# EAGLE design PCB (EAGLE 7.7.0)
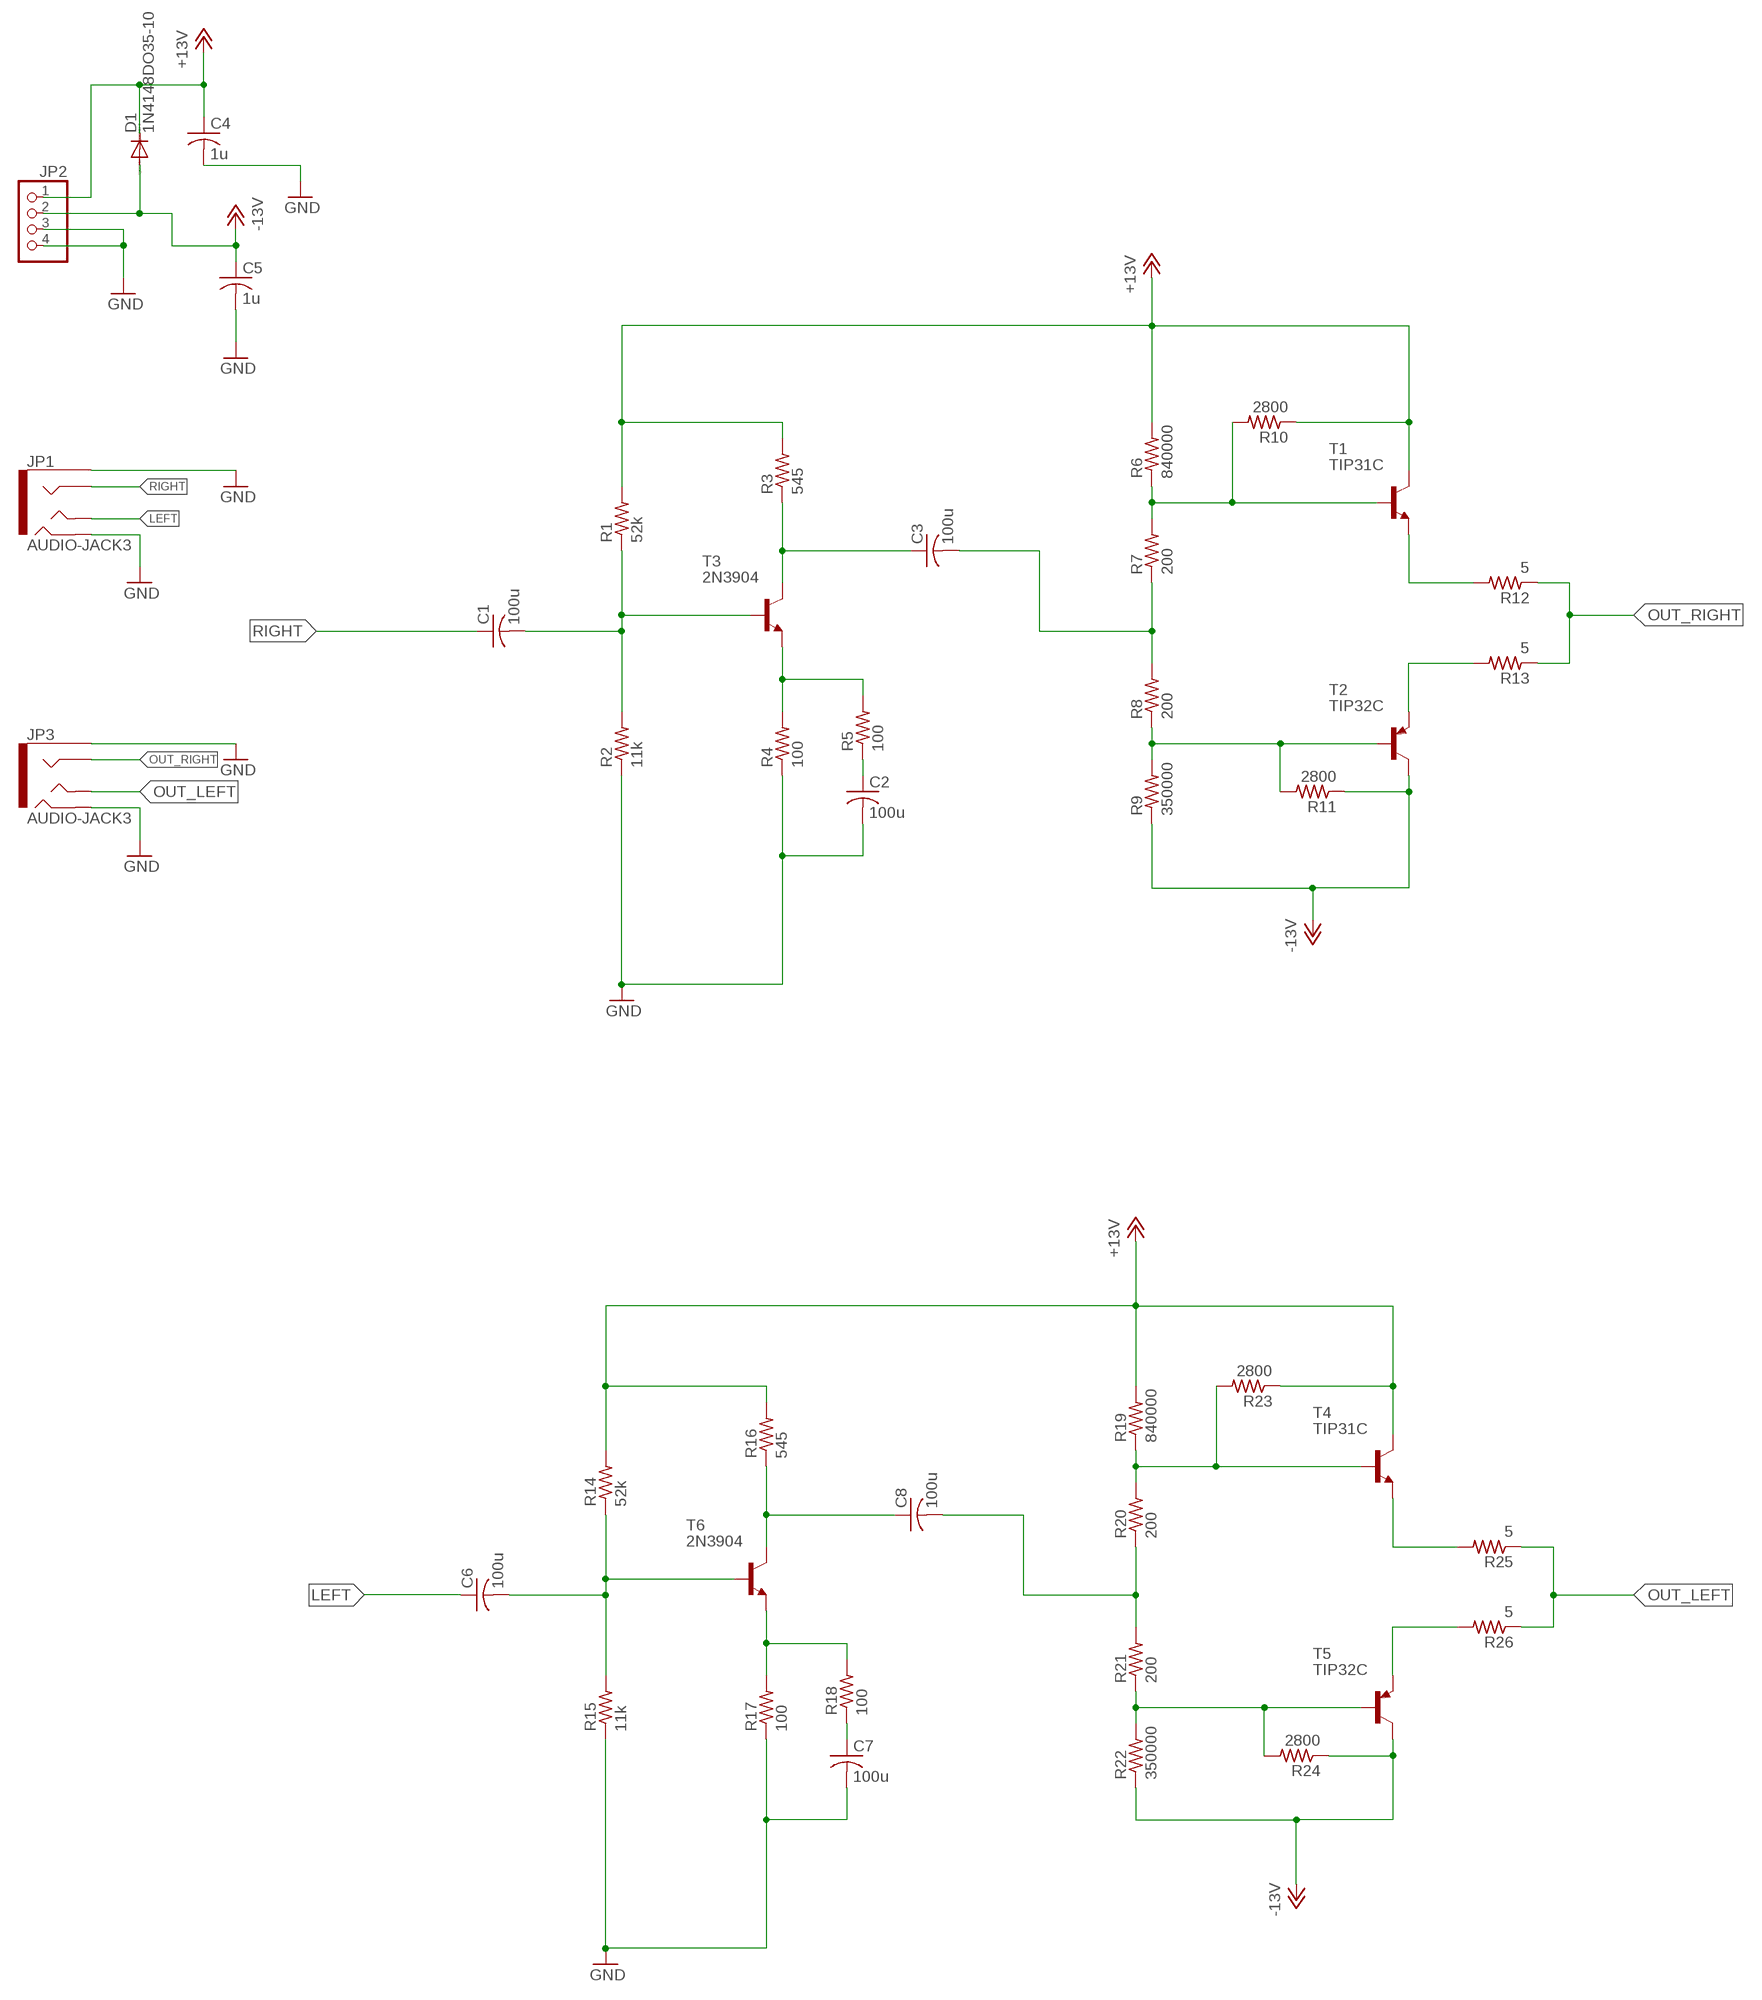
[diagram p0: schematic, sheet 1]

## Parts
C1  100u  C-US025-024X044  [C025-024X044]
C2  100u  C-US025-024X044  [C025-024X044]
C3  100u  C-US025-024X044  [C025-024X044]
C4  1u  C-US025-024X044  [C025-024X044]
C5  1u  C-US025-024X044  [C025-024X044]
C6  100u  C-US025-024X044  [C025-024X044]
C7  100u  C-US025-024X044  [C025-024X044]
C8  100u  C-US025-024X044  [C025-024X044]
D1  1N4148DO35-10  [DO35-10]
JP1  AUDIO-JACK3  [AUDIO-JACK-TRRS-SMD]
JP2  PINHD-1X4  [1X04]
JP3  AUDIO-JACK3  [AUDIO-JACK-TRRS-SMD]
R1  52k  R-US_0204/2V  [0204V]
R2  11k  R-US_0204/2V  [0204V]
R3  545  R-US_0204/2V  [0204V]
R4  100  R-US_0204/2V  [0204V]
R5  100  R-US_0204/2V  [0204V]
R6  840000  R-US_0204/2V  [0204V]
R7  200  R-US_0204/2V  [0204V]
R8  200  R-US_0204/2V  [0204V]
R9  350000  R-US_0204/2V  [0204V]
R10  2800  R-US_0204/2V  [0204V]
R11  2800  R-US_0204/2V  [0204V]
R12  5  R-US_0204/2V  [0204V]
R13  5  R-US_0204/2V  [0204V]
R14  52k  R-US_0204/2V  [0204V]
R15  11k  R-US_0204/2V  [0204V]
R16  545  R-US_0204/2V  [0204V]
R17  100  R-US_0204/2V  [0204V]
R18  100  R-US_0204/2V  [0204V]
R19  840000  R-US_0204/2V  [0204V]
R20  200  R-US_0204/2V  [0204V]
R21  200  R-US_0204/2V  [0204V]
R22  350000  R-US_0204/2V  [0204V]
R23  2800  R-US_0204/2V  [0204V]
R24  2800  R-US_0204/2V  [0204V]
R25  5  R-US_0204/2V  [0204V]
R26  5  R-US_0204/2V  [0204V]
T1  TIP31C  [TO220]
T2  TIP32C  [TO220]
T3  2N3904  [TO92]
T4  TIP31C  [TO220]
T5  TIP32C  [TO220]
T6  2N3904  [TO92]

## Nets
+13V: C4.1 D1.C JP2.1 R1.2 R3.2 R6.2 R10.1 R14.2 R16.2 R19.2 R23.1 T1.2(C) T4.2(C)
-13V: C5.1 D1.A JP2.2 R9.1 R11.1 R22.1 R24.1 T2.2(C) T5.2(C)
GND: C2.2 C4.2 C5.2 C7.2 JP1.EARTH JP1.RING2 JP2.3 JP2.4 JP3.EARTH JP3.RING2 R2.1 R4.1 R15.1 R17.1
LEFT: C6.1 JP1.TIP
N$1: C1.2 R1.1 R2.2 T3.2(B)
N$2: C3.1 R3.1 T3.1(C)
N$3: C6.2 R14.1 R15.2 T6.2(B)
N$4: R4.2 R5.2 T3.3(E)
N$5: R6.1 R7.2 R10.2 T1.1(B)
N$6: C2.1 R5.1
N$7: C3.2 R7.1 R8.2
N$8: R8.1 R9.2 R11.2 T2.1(B)
N$9: R12.2 T1.3(E)
N$10: R13.2 T2.3(E)
N$12: C8.1 R16.1 T6.1(C)
N$13: R17.2 R18.2 T6.3(E)
N$14: C7.1 R18.1
N$15: R19.1 R20.2 R23.2 T4.1(B)
N$16: C8.2 R20.1 R21.2
N$17: R21.1 R22.2 R24.2 T5.1(B)
N$18: R25.2 T4.3(E)
N$19: R26.2 T5.3(E)
OUT_LEFT: JP3.TIP R25.1 R26.1
OUT_RIGHT: JP3.RING1 R12.1 R13.1
RIGHT: C1.1 JP1.RING1

## Library data of the parts
C1-C8 = resistor:C-US: CAPACITOR, American symbol
D1 = diode:1N4148: DIODE high speed (Philips)
JP1 JP3 = SparkFun-Connectors:AUDIO-JACK3: Audio jack - 3.5mm TRRS variety - two rings.
JP2 = pinhead:PINHD-1X4: PIN HEADER
R1-R26 = resistor:R-US_: RESISTOR, American symbol
T1 T4 = transistor:TIP31: NPN Transistor Medium Power Linear Switching Applications Source: http://onsemi.com
T2 T5 = transistor:TIP32: PNP Transistor Medium Power Linear Switching Applications Source: http://onsemi.com
T3 T6 = transistor:2N3904: NPN TRANSISTOR

## Board
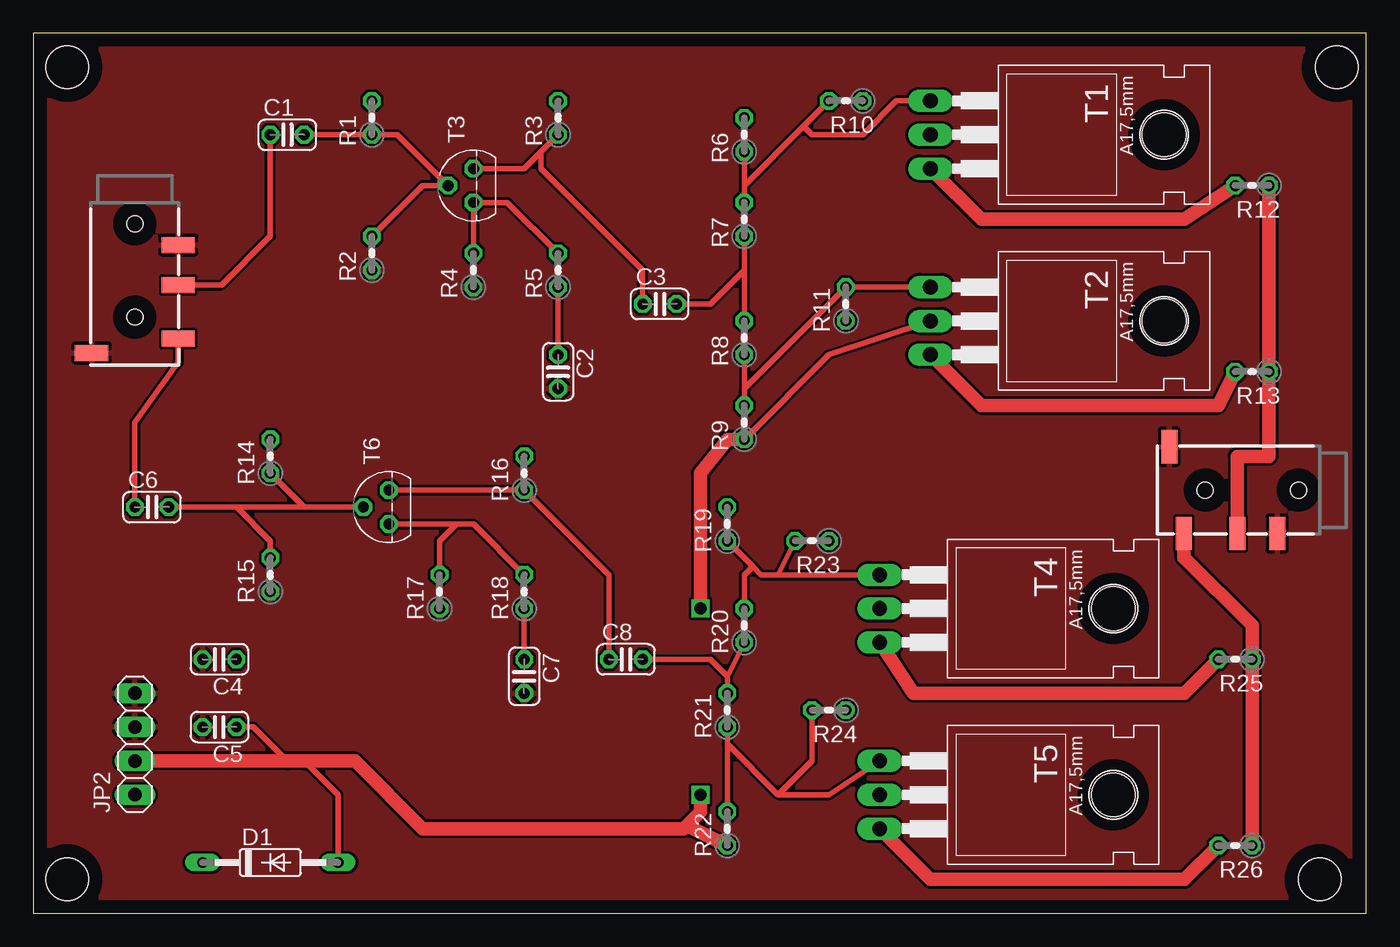
[diagram p1: board, top side]
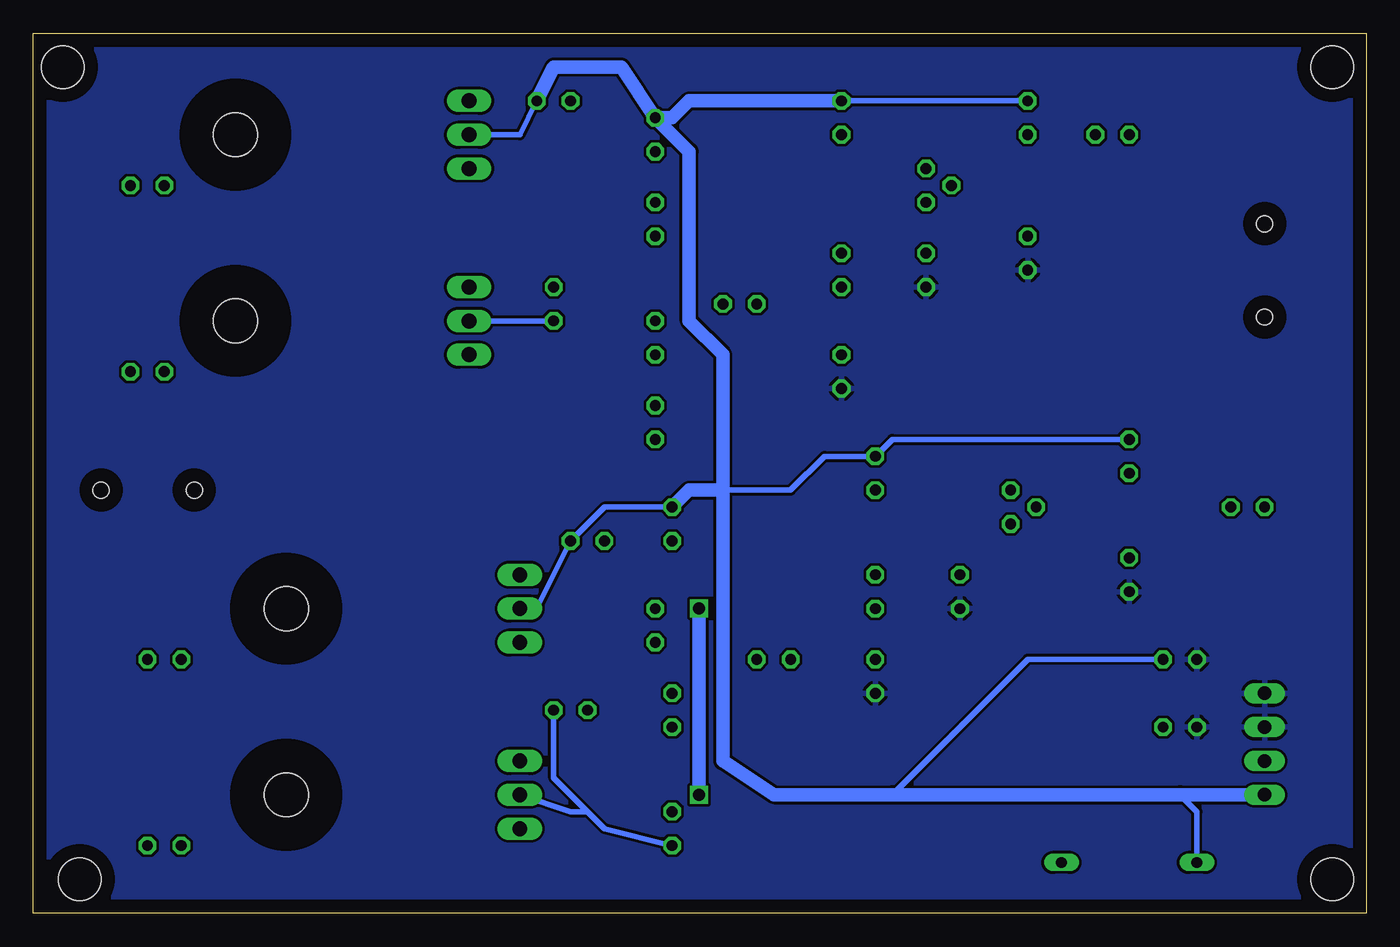
[diagram p2: board, bottom side, seen from below]

Size 100 x 66.03 mm. Coordinates in mm from the lower left corner, seen from the top.
Outline: 0,0 100,0 100,66.03 0,66.03 0,0
Copper layers (1*16): Top 0.035mm / dielectric 1.5mm / Bottom 0.035mm
Design rules "default": minimum track width 10mil, minimum drill 24mil, track to track 8mil, track to pad 8mil, pad to pad 8mil, via to via 8mil, smd to smd 8mil, copper to edge 40mil, drill to drill 8mil, minimum pad ring 10mil, minimum via ring 8mil, stop-mask expansion 4mil, vias tented up to drill 0mil, thermal gap 10mil
Holes 3.2 mm at 2.54,63.5 2.54,2.54 96.52,2.54 97.79,63.5

### Footprints (pad centres in the part's own frame; a part is rotated, then mirrored left to right if it is on the bottom)
C025-024X044 = drill 0.813 octagon: 1 -1.27,0; 2 1.27,0
DO35-10 = drill 0.813 long: A 5.08,0; C -5.08,0
AUDIO-JACK-TRRS-SMD = smd 1.2 x 2.5: EARTH 11.3,-3.25; RING1 6.2,3.25; RING2 3.2,3.25; TIP 10.2,3.25 | hole 1.2: 1.6,0; 8.6,0
1X04 = drill 1.016 long: 1 -3.81,0; 2 -1.27,0; 3 1.27,0; 4 3.81,0
0204V = drill 0.813 octagon: 1 -1.27,0; 2 1.27,0
TO220 = drill 1.118 long: 1 -2.54,-6.35; 2 0,-6.35; 3 2.54,-6.35 | hole 3.302: 0,11.176
TO92 = drill 0.813 octagon: 1 1.27,0; 2 0,1.905; 3 -1.27,0

### Placement (x,y rotation side)
C1  19.05,58.42 0 top
C2  39.37,40.64 270 top
C3  46.99,45.72 0 top
C4  13.97,19.05 180 top
C5  13.97,13.97 180 top
C6  8.89,30.48 0 top
C7  36.83,17.78 270 top
C8  44.45,19.05 0 top
D1  17.78,3.81 0 top
JP1  7.62,53.34 270 top
JP2  7.62,12.7 90 top
JP3  96.52,31.75 180 top
R1  25.4,59.69 90 top
R2  25.4,49.53 90 top
R3  39.37,59.69 90 top
R4  33.02,48.26 90 top
R5  39.37,48.26 90 top
R6  53.34,58.42 90 top
R7  53.34,52.07 90 top
R8  53.34,43.18 90 top
R9  53.34,36.83 90 top
R10  60.96,60.96 180 top
R11  60.96,45.72 90 top
R12  91.44,54.61 180 top
R13  91.44,40.64 180 top
R14  17.78,34.29 90 top
R15  17.78,25.4 90 top
R16  36.83,33.02 90 top
R17  30.48,24.13 90 top
R18  36.83,24.13 90 top
R19  52.07,29.21 90 top
R20  53.34,21.59 90 top
R21  52.07,15.24 90 top
R22  52.07,6.35 90 top
R23  58.42,27.94 180 top
R24  59.69,15.24 180 top
R25  90.17,19.05 180 top
R26  90.17,5.08 180 top
T1  73.66,58.42 270 top
T2  73.66,44.45 270 top
T3  33.02,54.61 90 top
T4  69.85,22.86 270 top
T5  69.85,8.89 270 top
T6  26.67,30.48 90 top

### Tracks (layer width: path | path; a pad name or v marks a point on that pad's centre or on a via)
+13V
  Bottom 0.406: R10.1 63.5,58.42 T1.2 | R19.2 57.15,30.48 R23.1 62.23,22.86 T4.2 | R3.2 R1.2 | 48.26,31.75 43.18,31.75 40.64,34.29 R16.2 35.56,35.56 R14.2 | C4.1 25.4,19.05 35.56,8.89 | D1.C 12.7,7.62 13.97,8.89
  Bottom 1.016: 48.26,31.75 48.26,11.43 44.45,8.89 35.56,8.89 13.97,8.89 JP2.1 | 48.26,31.75 48.26,41.91 50.8,44.45 50.8,57.15 R6.2 | R6.2 52.07,59.69 50.8,60.96 R3.2 | R6.2 55.88,63.5 60.96,63.5 R10.1 | R19.2 50.8,31.75 48.26,31.75
-13V  (via drill 0.9)
  Top 0.406: R9.1 59.69,41.91 T2.2 | C5.1 16.51,13.97 19.05,11.43 | D1.A 22.86,8.89 20.32,11.43
  Top 0.813: 49.53,6.35 48.77,6.35
  Top 1.016: 49.53,6.35 R22.1 | JP2.2 19.05,11.43 20.32,11.43 24.13,11.43 29.21,6.35 48.77,6.35 50.04,7.62 v50.04,8.89 | R9.1 52.07,35.56 50.04,33.02 v50.04,22.86
  Bottom 0.406: R22.1 57.15,6.35 58.42,7.62 | 58.42,7.62 60.96,10.16 R24.1 | T5.2 59.69,7.62 58.42,7.62 | R11.1 T2.2
  Bottom 1.016: v50.04,22.86 v50.04,8.89
GND
  pour Top: 0,67.31 101.6,67.31 101.6,-1.27 -1.27,-1.27 -1.27,67.31
  pour Bottom: -1.27,68.58 104.14,68.58 104.14,-2.54 -3.81,-2.54 -3.81,68.58
LEFT
  Top 0.406: JP1.TIP 10.87,41.35 7.62,36.83 C6.1
N$1
  Top 0.406: C1.2 R1.1 27.3,58.42 T3.2 29.21,54.61 R2.2
N$2
  Top 0.406: T3.1 36.83,55.88 38.1,57.15 | 38.1,57.15 R3.1 | C3.1 45.72,48.26 38.1,55.88 38.1,57.15
N$3
  Top 0.406: C6.2 15.24,30.48 | 15.24,30.48 20.32,30.48 | 20.32,30.48 T6.2 | R15.2 17.78,27.94 15.24,30.48 | R14.1 20.32,30.48
N$4
  Top 0.406: R4.2 T3.3 35.56,53.34 R5.2
N$5
  Top 0.406: R7.2 53.34,54.61 | 53.34,54.61 R6.1 | R10.2 57.78,59.06 | 57.78,59.06 53.34,54.61 | T1.1 64.77,60.96 62.23,58.42 58.42,58.42 57.78,59.06
N$6
  Top 0.406: R5.1 C2.1
N$7
  Top 0.406: C3.2 50.8,45.72 53.34,48.26 | R8.2 53.34,48.26 | 53.34,48.26 R7.1
N$8
  Top 0.406: 53.34,39.37 R9.2 | R8.1 53.34,39.37 | 53.34,39.37 R11.2 T2.1
N$9
  Top 1.016: T1.3 71.12,52.07 86.36,52.07 R12.2
N$10
  Top 1.016: T2.3 71.12,38.1 88.9,38.1 R13.2
N$12
  Top 0.406: T6.1 R16.1 43.18,25.4 C8.1
N$13
  Top 0.406: T6.3 31.75,29.21 | 31.75,29.21 33.02,29.21 R18.2 | R17.2 30.48,27.94 31.75,29.21
N$14
  Top 0.406: R18.1 C7.1
N$15
  Top 0.406: R23.2 55.88,25.4 | 55.88,25.4 T4.1 | R19.1 53.98,26.04 | 53.98,26.04 54.61,25.4 55.88,25.4 | R20.2 53.34,25.4 53.98,26.04
N$16
  Top 0.406: R21.2 52.07,17.78 | 52.07,17.78 R20.1 | C8.2 50.8,19.05 52.07,17.78
N$17
  Top 0.406: R22.2 R21.1 52.07,12.7 55.88,8.89 | 55.88,8.89 59.69,8.89 T5.1 | R24.2 58.42,11.43 55.88,8.89
N$18
  Top 1.016: T4.3 66.04,16.51 86.36,16.51 R25.2
N$19
  Top 1.016: T5.3 67.31,2.54 86.36,2.54 R26.2
OUT_LEFT
  Top 1.016: R26.1 R25.1 91.44,21.59 86.36,26.67 86.32,26.67 JP3.TIP
OUT_RIGHT
  Top 0.406: 90.17,28.65 JP3.RING1
  Top 1.016: R12.1 R13.1 92.71,34.29 90.32,34.29 JP3.RING1
RIGHT
  Top 0.406: JP1.RING1 14.12,47.14 17.78,50.8 C1.1